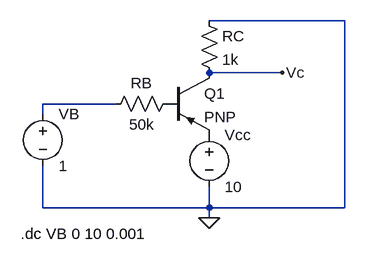
[diagram p0: schematic 1.2_exs.asc]
1.2_exs.asc, the LTspice schematic file:
Version 4
SHEET 1 880 680
WIRE 368 48 160 48
WIRE 272 128 160 128
WIRE 16 176 -96 176
WIRE -96 192 -96 176
WIRE -96 336 -96 272
WIRE 160 336 160 304
WIRE 160 336 -96 336
WIRE 368 336 368 48
WIRE 368 336 160 336
WIRE 160 352 160 336
FLAG 272 128 Vc
FLAG 160 352 0
SYMBOL pnp 96 128 R0
SYMATTR InstName Q1
SYMBOL res 144 32 R0
SYMATTR InstName RC
SYMATTR Value 1k
SYMBOL res 112 160 R90
WINDOW 0 0 56 VBottom 2
WINDOW 3 32 56 VTop 2
SYMATTR InstName RB
SYMATTR Value 50k
SYMBOL voltage 160 208 R0
SYMATTR InstName Vcc
SYMATTR Value 10
SYMBOL voltage -96 176 R0
WINDOW 123 0 0 Left 0
WINDOW 39 0 0 Left 0
SYMATTR InstName VB
SYMATTR Value 1
TEXT -130 376 Left 2 !.dc VB 0 10 0.001

The netlist it stands for:
* 1.2_exs.asc
Q1 Vc P001 P002 0 PNP
RC 0 Vc 1k
RB P001 N001 50k
Vcc P002 0 10
VB N001 0 1
.model NPN NPN
.model PNP PNP
.lib standard.bjt
.dc VB 0 10 0.001
.backanno
.end